# EAGLE schematic flyback_diode (EAGLE 6.4)
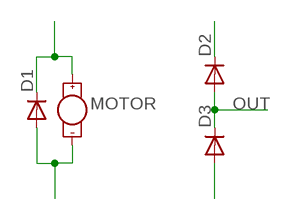
[diagram p0: schematic, sheet 1]

## Parts
D1  DIODE1N4148  [DIODE-1N4148]
D2  DIODE1N4148  [DIODE-1N4148]
D3  DIODE1N4148  [DIODE-1N4148]
MOTOR  MOTOR10MM  [VIBE-MOTOR-10MM]

## Nets
N$1: D1.C MOTOR.+
N$3: D1.A MOTOR.-
N$5: D3.A
N$7: D2.C
OUT: D2.A D3.C

## Library data of the parts
D1-D3 = SparkFun-DiscreteSemi:DIODE: Diode These are standard reverse protection diodes and small signal diodes. SMA package can handle up to about 1A. SOD-323 can handle about 200mA. What the SOD-323 package when ordering, there are some mfgs out there that are 5-pin packages.
MOTOR = SparkFun-Electromechanical:MOTOR: Vibration Motor- ROB-08449 Physical dimension and wire connections for this powerful vibration motor. Motor has a self adhesive backing.